# Altium schematic sheet MT8365_AUD.SchDoc
size A4; SheetNumber: 7; SheetTotal: 36
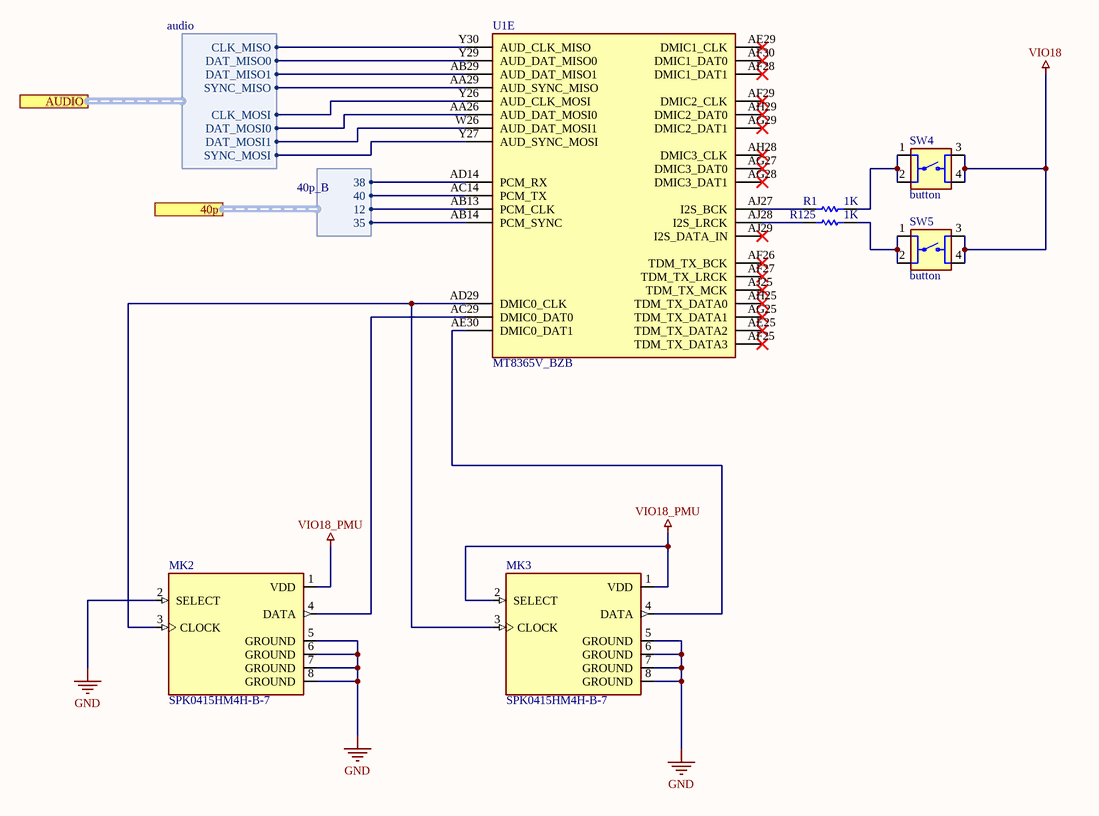
[diagram p0: MT8365_AUD.SchDoc]

## Parts
MK2  SPK0415HM4H-B-7  [MIC_SPK0415HM4H-B-7]
MK3  SPK0415HM4H-B-7  [MIC_SPK0415HM4H-B-7]
R1  value 1K  [R0603]  (hidden comment: R0603)
R125  value 1K  [R0603]  (hidden comment: R0603)
SW4  button  [BUTTON]
SW5  button  [BUTTON]
U1  MT8365V_BZB  [BGA633C40P30X29_1220X1180X90]  (part E of 11)

## Ports
40p (harness 40p_B, see MT8365[9500,5500], GPIOs[500,5200], MT8365[4600,3000], MT8365[7500,8900], MT8365[10000,5500], MT8365_CONN[10500,3000], MT8365_eMMC[8900,5600]), AUDIO (harness audio, see MT8365[9500,5800], AU[6600,8200], MT8365[10000,5800], Power[5400,3900])

## Harnesses
audio: CLK_MISO, DAT_MISO0, DAT_MISO1, SYNC_MISO, CLK_MOSI, DAT_MOSI0, DAT_MOSI1, SYNC_MOSI
40p_B: 12, 35, 38, 40

## Nets
GND: MK2.2(SELECT) MK2.5(GROUND) MK2.6(GROUND) MK2.7(GROUND) MK2.8(GROUND) MK3.5(GROUND) MK3.6(GROUND) MK3.7(GROUND) MK3.8(GROUND)
VIO18: SW4.3 SW4.4 SW5.3 SW5.4
VIO18_PMU: MK2.1(VDD) MK3.1(VDD) MK3.2(SELECT)
NetMK2_3: MK2.3(CLOCK) MK3.3(CLOCK) U1.AD29(DMIC0_CLK)
NetMK2_4: MK2.4(DATA) U1.AC29(DMIC0_DAT0)
NetMK3_4: MK3.4(DATA) U1.AE30(DMIC0_DAT1)
NetR1_1: R1.1 U1.AJ27(I2S_BCK)
NetR1_2: R1.2 SW4.1 SW4.2
NetR125_1: R125.1 U1.AJ28(I2S_LRCK)
NetR125_2: R125.2 SW5.1 SW5.2
NetU1_AA26: U1.AA26(AUD_DAT_MOSI0) ; port AUDIO.DAT_MOSI0
NetU1_AA29: U1.AA29(AUD_SYNC_MISO) ; port AUDIO.SYNC_MISO
NetU1_AB13: U1.AB13(PCM_CLK) ; port 40p.12
NetU1_AB14: U1.AB14(PCM_SYNC) ; port 40p.35
NetU1_AB29: U1.AB29(AUD_DAT_MISO1) ; port AUDIO.DAT_MISO1
NetU1_AC14: U1.AC14(PCM_TX) ; port 40p.40
NetU1_AD14: U1.AD14(PCM_RX) ; port 40p.38
NetU1_W26: U1.W26(AUD_DAT_MOSI1) ; port AUDIO.DAT_MOSI1
NetU1_Y26: U1.Y26(AUD_CLK_MOSI) ; port AUDIO.CLK_MOSI
NetU1_Y27: U1.Y27(AUD_SYNC_MOSI) ; port AUDIO.SYNC_MOSI
NetU1_Y29: U1.Y29(AUD_DAT_MISO0) ; port AUDIO.DAT_MISO0
NetU1_Y30: U1.Y30(AUD_CLK_MISO) ; port AUDIO.CLK_MISO

Not connected (* = marked no-connect by the designer): U1 AE25(TDM_TX_DATA2)* AE29(DMIC1_CLK)* AF25(TDM_TX_DATA3)* AF26(TDM_TX_BCK)* AF27(TDM_TX_LRCK)* AF28(DMIC1_DAT1)* AF29(DMIC2_CLK)* AF30(DMIC1_DAT0)* AG25(TDM_TX_DATA1)* AG27(DMIC3_DAT0)* AG28(DMIC3_DAT1)* AG29(DMIC2_DAT1)* AH25(TDM_TX_DATA0)* AH28(DMIC3_CLK)* AH29(DMIC2_DAT0)* AJ25(TDM_TX_MCK)* AJ29(I2S_DATA_IN)*

## Library data of the parts
MK2 MK3 = SPK0415HM4H-B-7: 100Hz ~ 10kHz Digital, PDM Microphone MEMS _Silicon_ 1.6V ~ 3.6V Omnidirectional _-26dB Â±3dB @ 94dB SPL_ Solder Pads
SW4 SW5 = button: 6x6 mm
U1 = MT8365V_BZB: SoC; Manufacturer_Name: Mediatek; Manufacturer_Part_Number: MT8365V/BZB; Datasheet Link: https://www.mouser.co.uk/datasheet/2/1074/MT8365_AIoT_Application_Processor_Datasheet_v1_0_2-3106631.pdf; Height: 0.9mm; Mouser Part Number: 840-MT8365V/BZB; Mouser Price/Stock: https://www.mouser.co.uk/ProductDetail/MediaTek/MT8365V-BZB?qs=Jm2GQyTW%2FbjcedX9ugwNWQ%3D%3D